# EAGLE design btnsm_a_bit_larger (EAGLE 8.6.0)
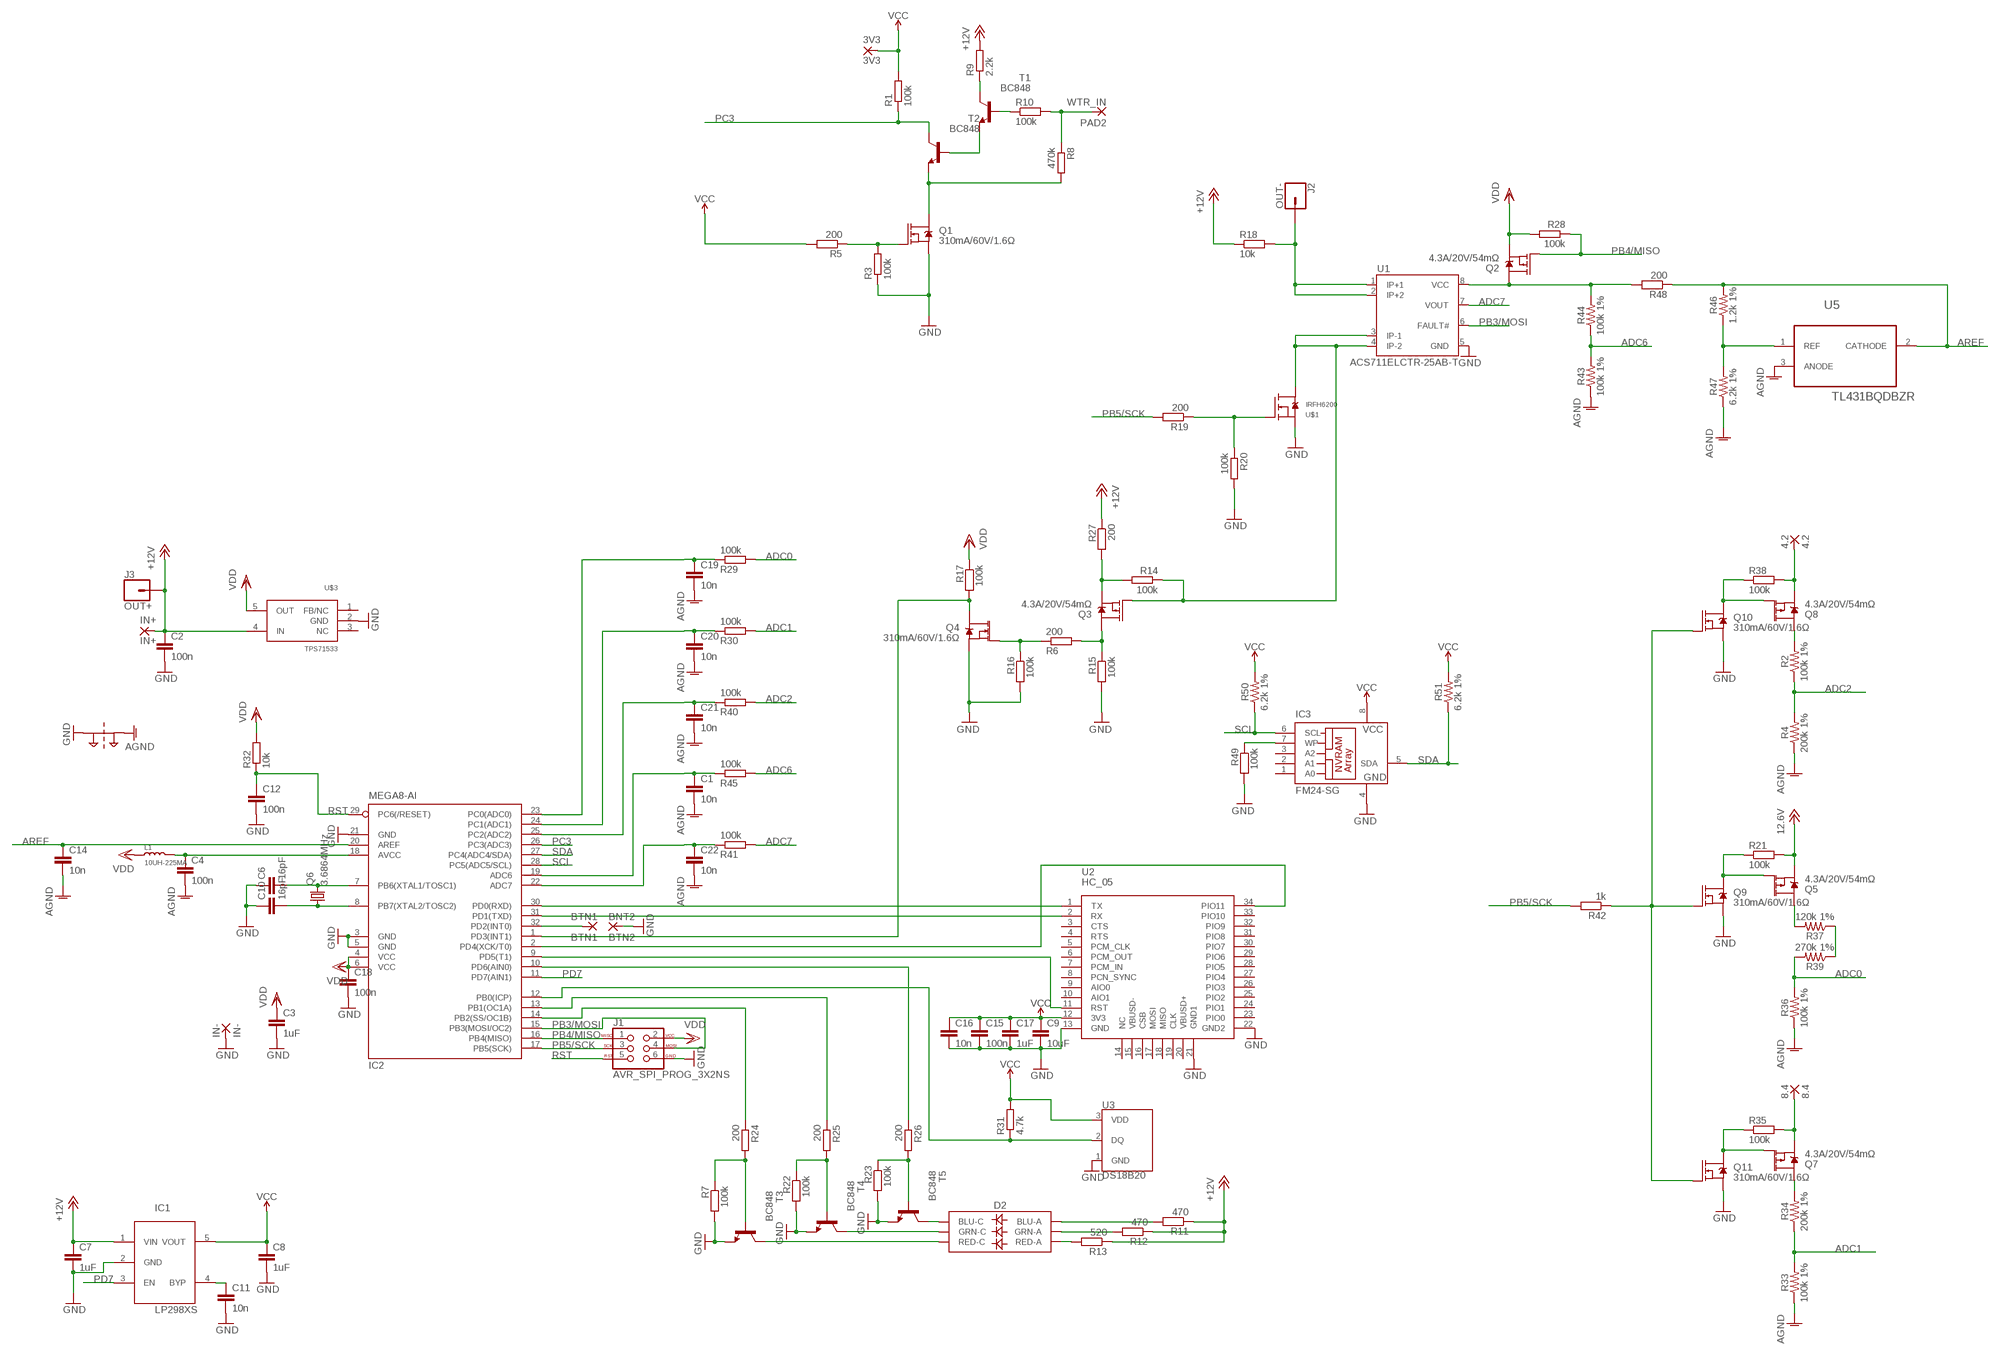
[diagram p0: schematic, sheet 1]

## Parts
3V3  3V3  WIREPADSMD1,27-254  [SMD1,27-2,54]
4.2  4.2  WIREPADSMD1,27-254  [SMD1,27-2,54]
8.4  8.4  WIREPADSMD1,27-254  [SMD1,27-2,54]
BTN1  BTN1  1,6/0,9  [1,6/0,9]
BTN2  BNT2  1,6/0,9  [1,6/0,9]
C1  10n  C-EUC0402  [C0402]
C2  100n  C-EUC0603  [C0603]
C3  1uF  C-EUC0805  [C0805]
C4  100n  C-EUC0402  [C0402]
C6  16pF  C-EUC0402  [C0402]
C7  1uF  C-EUC0805  [C0805]
C8  1uF  C-EUC0805  [C0805]
C9  10uF  C-EUC0805  [C0805]
C10  16pF  C-EUC0402  [C0402]
C11  10n  C-EUC0402  [C0402]
C12  100n  C-EUC0402  [C0402]
C14  10n  C-EUC0402  [C0402]
C15  100n  C-EUC0402  [C0402]
C16  10n  C-EUC0402  [C0402]
C17  1uF  C-EUC0805  [C0805]
C18  100n  C-EUC0402  [C0402]
C19  10n  C-EUC0402  [C0402]
C20  10n  C-EUC0402  [C0402]
C21  10n  C-EUC0402  [C0402]
C22  10n  C-EUC0402  [C0402]
D2  LED-RGBNO_IC  [LED-TRICOLOR-5050]
IC1  LP298XS  [SOT23-5L]
IC2  MEGA8-AI  [TQFP32-08]
IC3  FM24-SG  [SO8]
IN+  IN+  SMD5  [SMD2,54-5,08]
IN-  IN-  SMD5  [SMD2,54-5,08]
J1  AVR_SPI_PROG_3X2NS  [2X3-NS]
J2  OUT-  CONN_01PTH_2MM  [1X01_2MM]
J3  OUT+  CONN_01PTH_2MM  [1X01_2MM]
L1  10UH-225MA  SMD-INDUCTOR-10UH-225MA-10%(0806)  [L0806]
PAD2  WTR_IN  WIREPADSMD1,27-254  [SMD1,27-2,54]
Q1  310mA/60V/1.6Ω  MOSFET-NCH-2N7002PW  [SOT323]
Q2  4.3A/20V/54mΩ  MOSFET_PCH-IRLML2244  [SOT23-3]
Q3  4.3A/20V/54mΩ  MOSFET_PCH-IRLML2244  [SOT23-3]
Q4  310mA/60V/1.6Ω  MOSFET-NCH-2N7002PW  [SOT323]
Q5  4.3A/20V/54mΩ  MOSFET_PCH-IRLML2244  [SOT23-3]
Q6  3.6864MHz  CRYSTALHC49S  [HC49/S]
Q7  4.3A/20V/54mΩ  MOSFET_PCH-IRLML2244  [SOT23-3]
Q8  4.3A/20V/54mΩ  MOSFET_PCH-IRLML2244  [SOT23-3]
Q9  310mA/60V/1.6Ω  MOSFET-NCH-2N7002PW  [SOT323]
Q10  310mA/60V/1.6Ω  MOSFET-NCH-2N7002PW  [SOT323]
Q11  310mA/60V/1.6Ω  MOSFET-NCH-2N7002PW  [SOT323]
R1  100k  R-EU_R0402  [R0402]
R2  100k 1%  RESISTOR0805  [0805]
R3  100k  R-EU_R0402  [R0402]
R4  200k 1%  RESISTOR0805  [0805]
R5  200  R-EU_R0402  [R0402]
R6  200  R-EU_R0402  [R0402]
R7  100k  R-EU_R0402  [R0402]
R8  470k  R-EU_R0402  [R0402]
R9  2.2k  R-EU_R0402  [R0402]
R10  100k  R-EU_R0402  [R0402]
R11  470  R-EU_R0805  [R0805]
R12  470  R-EU_R0805  [R0805]
R13  520  R-EU_R0805  [R0805]
R14  100k  R-EU_R0402  [R0402]
R15  100k  R-EU_R0402  [R0402]
R16  100k  R-EU_R0402  [R0402]
R17  100k  R-EU_R0402  [R0402]
R18  10k  R-EU_R0402  [R0402]
R19  200  R-EU_R0402  [R0402]
R20  100k  R-EU_R0402  [R0402]
R21  100k  R-EU_R0402  [R0402]
R22  100k  R-EU_R0402  [R0402]
R23  100k  R-EU_R0402  [R0402]
R24  200  R-EU_R0402  [R0402]
R25  200  R-EU_R0402  [R0402]
R26  200  R-EU_R0402  [R0402]
R27  200  R-EU_R0402  [R0402]
R28  100k  R-EU_R0402  [R0402]
R29  100k  R-EU_R0402  [R0402]
R30  100k  R-EU_R0402  [R0402]
R31  4.7k  R-EU_R0402  [R0402]
R32  10k  R-EU_R0402  [R0402]
R33  100k 1%  RESISTOR0805  [0805]
R34  200k 1%  RESISTOR0805  [0805]
R35  100k  R-EU_R0402  [R0402]
R36  100k 1%  RESISTOR0805  [0805]
R37  120k 1%  RESISTOR0805  [0805]
R38  100k  R-EU_R0402  [R0402]
R39  270k 1%  RESISTOR0805  [0805]
R40  100k  R-EU_R0402  [R0402]
R41  100k  R-EU_R0402  [R0402]
R42  1k  R-EU_R0402  [R0402]
R43  100k 1%  RESISTOR0805  [0805]
R44  100k 1%  RESISTOR0805  [0805]
R45  100k  R-EU_R0402  [R0402]
R46  1.2k 1%  RESISTOR0805  [0805]
R47  6.2k 1%  RESISTOR0805  [0805]
R48  200  R-EU_R0402  [R0402]
R49  100k  R-EU_R0402  [R0402]
R50  6.2k 1%  RESISTOR0805  [0805]
R51  6.2k 1%  RESISTOR0805  [0805]
SUPPLY7  2PT_GND_TIE  [2PT_GND_TIE]
T1  BC848  [SOT23]
T2  BC848  [SOT23]
T3  BC848  [SOT23]
T4  BC848  [SOT23]
T5  BC848  [SOT23]
U1  ACS711ELCTR-25AB-T  [SOIC8]
U2  HC_05  [BLUETOOTH_SMD]
U3  DS18B20  [TO-92-AMMO]
U5  TL431BQDBZR  [SOT95P237X112-3N]
U$1  IRFH6200  [PQFN]
U$3  TPS71533  TPS715  [SC70]

## Nets
+12V [PWR]: C2.1 C7.1 IC1.1(VIN) IN+.1(P) J3.1 Q5.2(S) R9.2 R11.1 R12.1 R13.1 R18.1 R21.2 R27.1 U$3.4(IN) ; supply symbol labelled 12.6V
_A0: C19.1 IC2.23(PC0(ADC0)) R29.1
_A1: C20.1 IC2.24(PC1(ADC1)) R30.1
_A2: C21.1 IC2.25(PC2(ADC2)) R40.1
_A6: C1.1 IC2.19(ADC6) R45.1
_A7: C22.1 IC2.22(ADC7) R41.1
ADC0 [ADC]: R29.2 R36.2 R39.2
ADC1 [ADC]: R30.2 R33.2 R34.1
ADC2 [ADC]: R2.1 R4.2 R40.2
ADC6 [ADC]: R43.2 R44.1 R45.2
ADC7 [ADC]: R41.2 U1.7(VOUT)
AGND [ADC]: C1.2 C4.2 C14.2 C19.2 C20.2 C21.2 C22.2 R4.1 R33.1 R36.1 R43.1 R47.1 SUPPLY7.P$2 U5.3(ANODE)
AREF [ADC]: C14.1 IC2.20(AREF) R46.2 R48.1 U5.2(CATHODE)
AVCC [ADC]: C4.1 IC2.18(AVCC) L1.2
B+: D2.3(BLU-A) R11.2
B-: D2.4(BLU-C) T5.3(C)
B-BASE: R23.1 R26.2 T5.1(B)
BTN1: BTN1.1(P) IC2.32(PD2(INT0))
G+: D2.1(GRN-A) R12.2
G-: D2.6(GRN-C) T4.3(C)
G-BASE: R22.1 R25.2 T4.1(B)
GND [PWR]: BTN2.1(P) C2.2 C3.2 C6.1 C7.2 C8.2 C9.2 C10.1 C11.2 C12.2 C15.2 C16.2 C17.2 C18.2 IC1.2(GND) IC2.3(GND) IC2.5(GND) IC2.21(GND) IC3.4(GND) IN-.1(P) J1.6 Q1.2(S) Q4.2(S) Q9.2(S) Q10.2(S) Q11.2(S) R3.1 R7.2 R15.2 R16.2 R20.2 R22.2 R23.2 R49.2 SUPPLY7.P$1 T3.2(E) T4.2(E) T5.2(E) U1.5(GND) U2.13(GND) U2.21(GND1) U2.22(GND2) U3.1(GND) U$1.1(S) U$1.2(S) U$1.3(S) U$3.2(GND)
GND_OUT: J2.1 R18.2 U1.1(IP+1) U1.2(IP+2)
GND_OUT_MEASURE: Q3.1(G) R14.1 U1.3(IP-1) U1.4(IP-2) U$1.5(D) U$1.6(D) U$1.7(D) U$1.8(D) U$1.9(D)
N$1: Q4.1(G) R6.1 R16.1
N$2: C11.1 IC1.4(BYP)
N$3: Q7.1(G) Q11.3(D) R35.1
N$4: Q1.3(D) R8.2 T2.2(E)
N$5: Q7.3(D) R34.2
N$6: Q8.1(G) Q10.3(D) R38.1
N$7: Q8.3(D) R2.2
N$8: R37.1 R39.1
N$9: Q3.3(D) R6.2 R15.1
N$10 [PWR]: 8.4.1(P) Q7.2(S) R35.2
N$11: Q5.1(G) Q9.3(D) R21.1
N$12 [PWR]: 4.2.1(P) Q8.2(S) R38.2
N$13: T1.2(E) T2.1(B)
N$14: Q2.3(D) R44.2 R48.2 U1.8(VCC)
N$17: R10.1 T1.1(B)
N$19: Q9.1(G) Q10.1(G) Q11.1(G) R42.1
N$23: Q5.3(D) R37.2
N$26 [ADC]: IC3.7(WP) R49.1
N$32: Q3.2(S) R14.2 R27.2
OUT_BASE: R19.1 R20.1 U$1.4(G)
PB0: IC2.12(PB0(ICP)) R31.1 U3.2(DQ)
PB1: IC2.13(PB1(OC1A)) R25.1
PB2: IC2.14(PB2(SS/OC1B)) R24.1
PB3/MOSI: IC2.15(PB3(MOSI/OC2)) J1.4 U1.6(FAULT#)
PB4/MISO: IC2.16(PB4(MISO)) J1.1 Q2.1(G) R28.1
PB5/SCK: IC2.17(PB5(SCK)) J1.3 R19.2 R42.2
PB6: C6.2 IC2.7(PB6(XTAL1/TOSC1)) Q6.2
PB7: C10.2 IC2.8(PB7(XTAL2/TOSC2)) Q6.1
PC3: IC2.26(PC3(ADC3)) R1.1 T2.3(C)
PD3: IC2.1(PD3(INT1)) Q4.3(D) R17.2
PD4-HC05_KEY: IC2.2(PD4(XCK/T0)) U2.34(PIO11)
PD5-HC05_RST: IC2.9(PD5(T1)) U2.11(RST)
PD6(PWM0): IC2.10(PD6(AIN0)) R26.1
PD7: IC1.3(EN) IC2.11(PD7(AIN1))
R+: D2.2(RED-A) R13.2
R-: D2.5(RED-C) T3.3(C)
R-BASE: R7.1 R24.2 T3.1(B)
REF: R46.1 R47.2 U5.1(REF)
RST: C12.1 IC2.29(PC6(/RESET)) J1.5 R32.1
RX(UC): IC2.30(PD0(RXD)) U2.1(TX)
SCL: IC2.28(PC5(ADC5/SCL)) IC3.6(SCL) R50.1
SDA: IC2.27(PC4(ADC4/SDA)) IC3.5(SDA) R51.1
TX(UC): IC2.31(PD1(TXD)) U2.2(RX)
VCC [PWR]: 3V3.1(P) C8.1 C9.1 C15.1 C16.1 C17.1 IC1.5(VOUT) IC3.8(VCC) R1.2 R5.2 R31.2 R50.2 R51.2 U2.12(3V3) U3.3(VDD)
VDD [PWR]: C3.1 C18.1 IC2.4(VCC) IC2.6(VCC) J1.2 L1.1 Q2.2(S) R17.1 R28.2 R32.2 U$3.5(OUT)
WTR-IN: PAD2.1(P) R8.1 R10.2
WTR_MEASURE_ON: Q1.1(G) R3.2 R5.1
WTR_MEASURE_PULLUP: R9.1 T1.3(C)
Unconnected: IC3.1(A0) IC3.2(A1) IC3.3(A2) U2.3(CTS) U2.4(RTS) U2.5(PCM_CLK) U2.6(PCM_OUT) U2.7(PCM_IN) U2.8(PCN_SYNC) U2.9(AIO0) U2.10(AIO1) U2.14(NC) U2.15(VBUSD-) U2.16(CSB) U2.17(MOSI) U2.18(MISO) U2.19(CLK) U2.20(VBUSD+) U2.23(PIO0) U2.24(PIO1) U2.25(PIO2) U2.26(PIO3) U2.27(PIO4) U2.28(PIO5) U2.29(PIO6) U2.30(PIO7) U2.31(PIO8) U2.32(PIO9) U2.33(PIO10) U$3.1(FB/NC) U$3.3(NC)

## Library data of the parts
3V3 4.2 8.4 PAD2 = wirepad:WIREPAD: Wire PAD connect wire on PCB
BTN1 BTN2 = wirepad:1,6/0,9: THROUGH-HOLE PAD
C1-C4 C6-C12 C14-C22 = resistor:C-EU: CAPACITOR, European symbol
D2 = SparkFun-LED:LED-RGB: LED-RGB 6 pin RGB LED (no common connector) Packages: PLCC-6 LED-TRICOLOR-5050 - No built-in IC SparkFun Products: Digital Sandbox <https://www.sparkfun.com/products/12651> LED- SMD RGB <https://www.sparkfun.com/products/10866>; PROD_ID: DIO-10298
IC1 = adafruit:LP298X
IC2 = atmel:MEGA8: MICROCONTROLLER 8 Kbytes FLASH, 1 kbytes SRAM, 512 bytes EEPROM, USART, 6-channel 10 bit ADC, 2-channel 8 bit ADC Pin compatible with Atmega48, ATMega88, ATMega168 Source: avr.lbr; MPN: ATMEGA8-16AU; OC_FARNELL: 9171371; OC_NEWARK: 73M8863
IC3 = ramtron-2:FM24*: I2C NVRAM 8 pin
IN+ IN- = wirepad:SMD5: SMD PAD
J1 = SparkFun-Connectors:AVR_SPI_PROG_3X2: AVR ISP 6 Pin This is the reduced ISP connector for AVR programming. Common on Arduino. This footprint will take up less PCB space and can be used with a 10-pin to 6-pin adapter such as SKU: BOB-08508 **Special note about "TEST_POINT" package. The stop mask is on the top side, so if you want your programming test points to be on the bottom of your board, make sure to place this package on the bottom side of the board. This also ensure that the orientation to program from the bottom side will be correct. SparkFun Products: SparkFun ISP Pogo Adapter <https://www.sparkfun.com/products/11591> - NS Tiny AVR Programmer <https://www.sparkfun.com/products/11801> -PTH
J2 J3 = SparkFun-Connectors:CONN_01: Single connection point. Often used as Generic Header-pin footprint for 0.1 inch spaced/style header connections On any of the 0.1 inch spaced packages, you can populate with these: Break Away Headers - Straight <https://www.sparkfun.com/products/116> (PRT-00116) Break Away Male Headers - Right Angle <https://www.sparkfun.com/products/553> (PRT-00553) Female Headers <https://www.sparkfun.com/products/115> (PRT-00115) Break Away Headers - Machine Pin <https://www.sparkfun.com/products/117> (PRT-00117) Break Away Female Headers - Swiss Machine Pin <https://www.sparkfun.com/products/743> (PRT-00743) This device is also useful as a general connection point to wire up your design to another part of your project. Our various solder wires solder well into these plated through hole pads. Hook-Up Wire - Assortment (Stranded, 22 AWG) <https://www.sparkfun.com/products/11375> (PRT-11375) Hook-Up Wire - Assortment (Solid Core, 22 AWG) <https://www.sparkfun.com/products/11367> (PRT-11367) View the entire wire category on our website here <https://www.sparkfun.com/categories/141> Special notes: SMTSO-256-ET is a "flush mount" nut for a 4-40 screw. We mostly use this on specialty testbeds; it is a nice way to connect hardware to your PCB at an adjustable hieght. Also note, the SNAP packages are for using a snappable style connector. We sell a baggie of snaps and they are also used on two LilyPad designs: Snap Assortment - 30 pack (male and female) <https://www.sparkfun.com/products/11347> (DEV-11347) LilyPad Arduino SimpleSnap <https://www.sparkfun.com/products/10941> (DEV-10941) LilyPad SimpleSnap Protoboard <https://www.sparkfun.com/products/10940> (DEV-10940)
L1 = Seeed-Inductor:SMD-INDUCTOR-10UH-225MA-10%(0806): 303010042; MPN: LQH2MCN100K02L
Q1 Q4 Q9-Q11 = SparkFun-DiscreteSemi:MOSFET-NCH: N-channel MOSFETs Voltage controlled devices that allow control of high current outputs. SparkFun Products: SparkFun OpenScale <https://www.sparkfun.com/products/13261> SparkFun Digital Sandbox <https://www.sparkfun.com/products/12651> SparkFun Monster Moto Shield <https://www.sparkfun.com/products/10182> SparkFun MOSFET Power Controller <https://www.sparkfun.com/products/11214>; PROD_ID: TRANS-11151
Q2 Q3 Q5 Q7 Q8 = SparkFun-DiscreteSemi:MOSFET_PCH: P-channel MOSFETs Voltage controlled devices that allow control of high current outputs. SparkFun Products: SparkFun ESP32 Thing <https://www.sparkfun.com/products/13907> SparkFun ESP8266 Thing <https://www.sparkfun.com/products/13231>; PROD_ID: TRANS-11153
Q6 = adafruit:CRYSTAL: CRYSTAL; OC_FARNELL: 1667008; OC_NEWARK: unknown
R1 R3 R5-R32 R35 R38 R40-R42 R45 R48 R49 = rcl:R-EU_: RESISTOR, European symbol; SPICEPREFIX: R
R2 R4 R33 R34 R36 R37 R39 R43 R44 R46 R47 R50 R51 = SparkFun-Resistors:RESISTOR: Generic Resistor Package
SUPPLY7 = SparkFun-PowerSymbols:2PT_GND_TIE: Dual Ground Supply Power supply symbol for connecting two grounds. SparkFun Products: SparkFun AutoDriver - Stepper Motor Driver <https://www.sparkfun.com/products/11611>
T1 T3-T5 = transistor-neu-to92:BC848: NPN TRANSISTOR
T2 = transistor-neu-to92:BC848: NPN TRANSISTOR; SPICEPREFIX: Q
U1 = allegro:ACS711E: SENSOR CURRENT 3.3V 8-SOIC tested: YES (etherbotix); CURRENT: 25A
U2 = Bluetooth HC-05:HC_05: HC-05 Bluetooth Module
U3 = SparkFun-Sensors:DS18B20: Dallas/Maxim DS18B20 1-Wire Temperature Sensor The DS18B20 reports degrees C with 9 to 12-bit precision, -55C to 125C (+/-0.5C). Each sensor has a unique 64-Bit Serial number etched into it - allows for a huge number of sensors to be used on one data bus. Datasheet <http://datasheets.maximintegrated.com/en/ds/DS18B20.pdf> SparkFun Products One Wire Digital Temperature Sensor - DS18B20 <https://www.sparkfun.com/products/245> (SEN-00245); STORE_ID: SEN-00245
U5 = TL431BQDBZR:TL431BQDBZR: PRECISION PROGRAMMABLE REFERENCE; MPN: TL431BQDBZR; OC_FARNELL: 1764815; OC_NEWARK: 44J2402; PACKAGE: SOT23-3; SUPPLIER: Texas Instruments
U$1 = IRFH6200:IRFH6200
U$3 = TPS715:TPS715

## Net classes
0 default: width 0.152 mm, drill 0.3 mm, clearance 0.152 mm
1 PWR: width 0.381 mm, drill 0.4 mm, clearance 0.152 mm
2 ADC: width 0.254 mm, drill 0.3 mm, clearance 0.152 mm

## Board
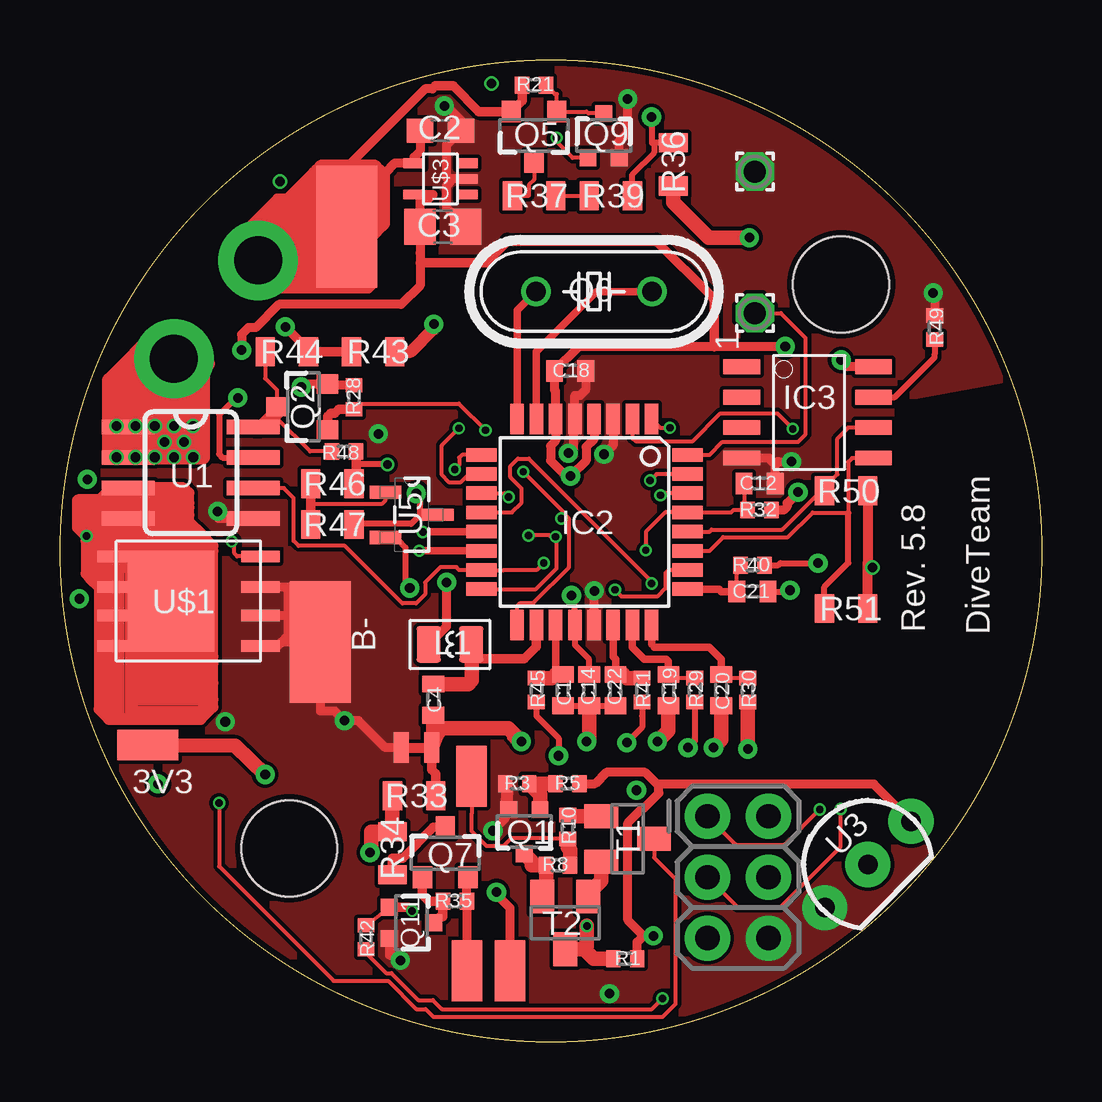
[diagram p1: board, top side]
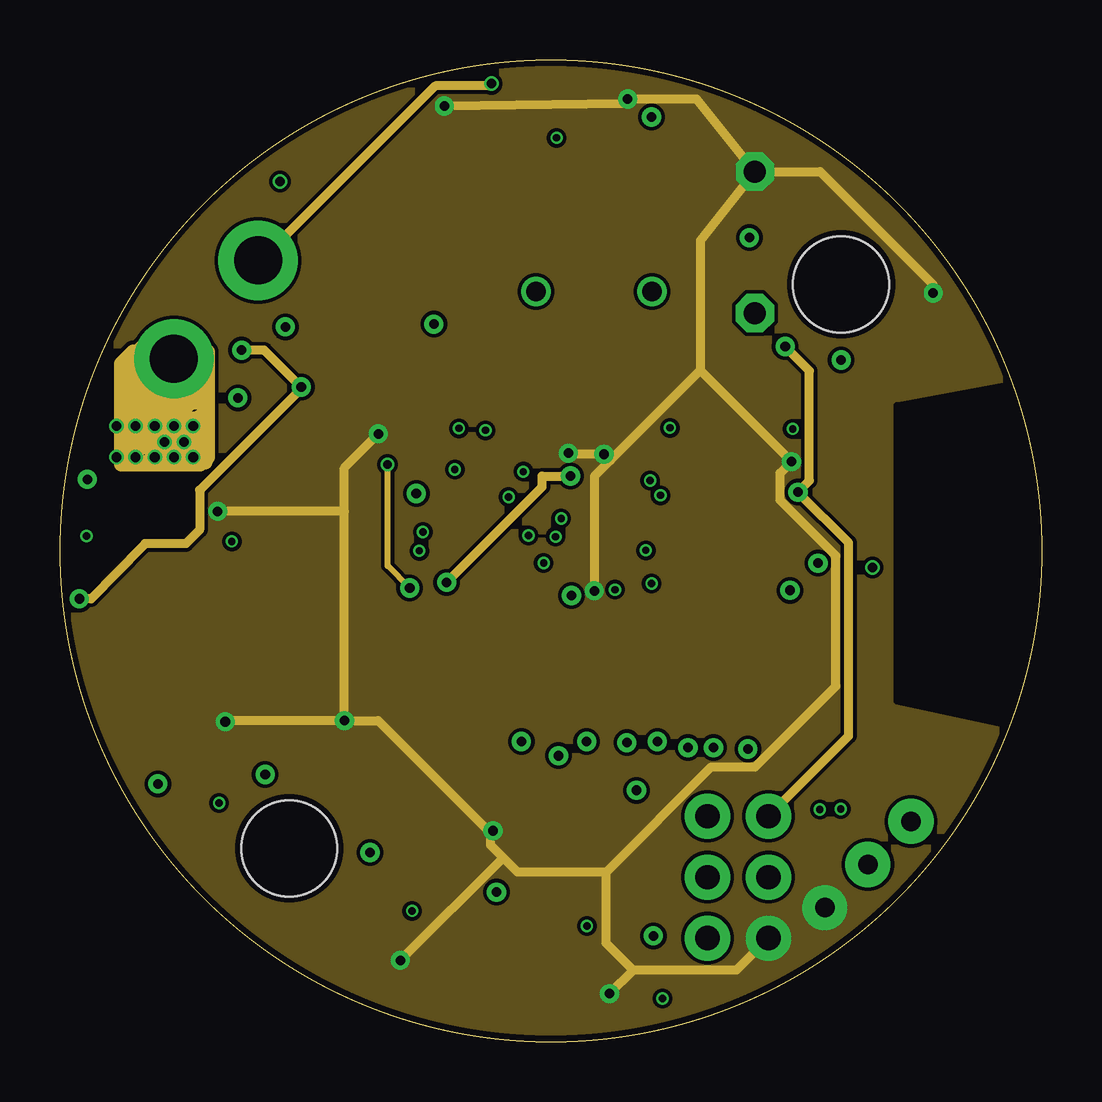
[diagram p2: board, inner layer Route2]
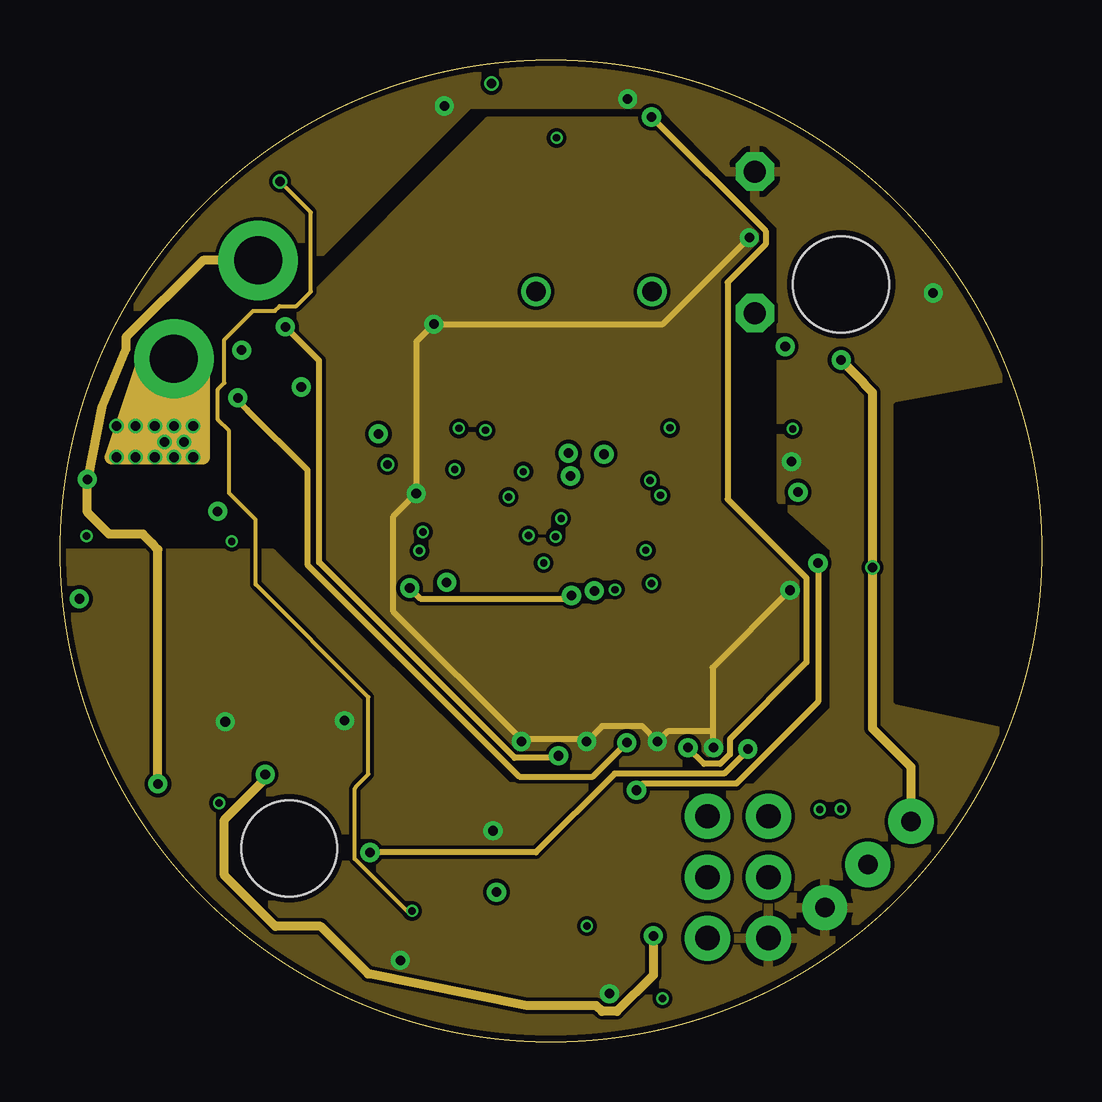
[diagram p3: board, inner layer Route15]
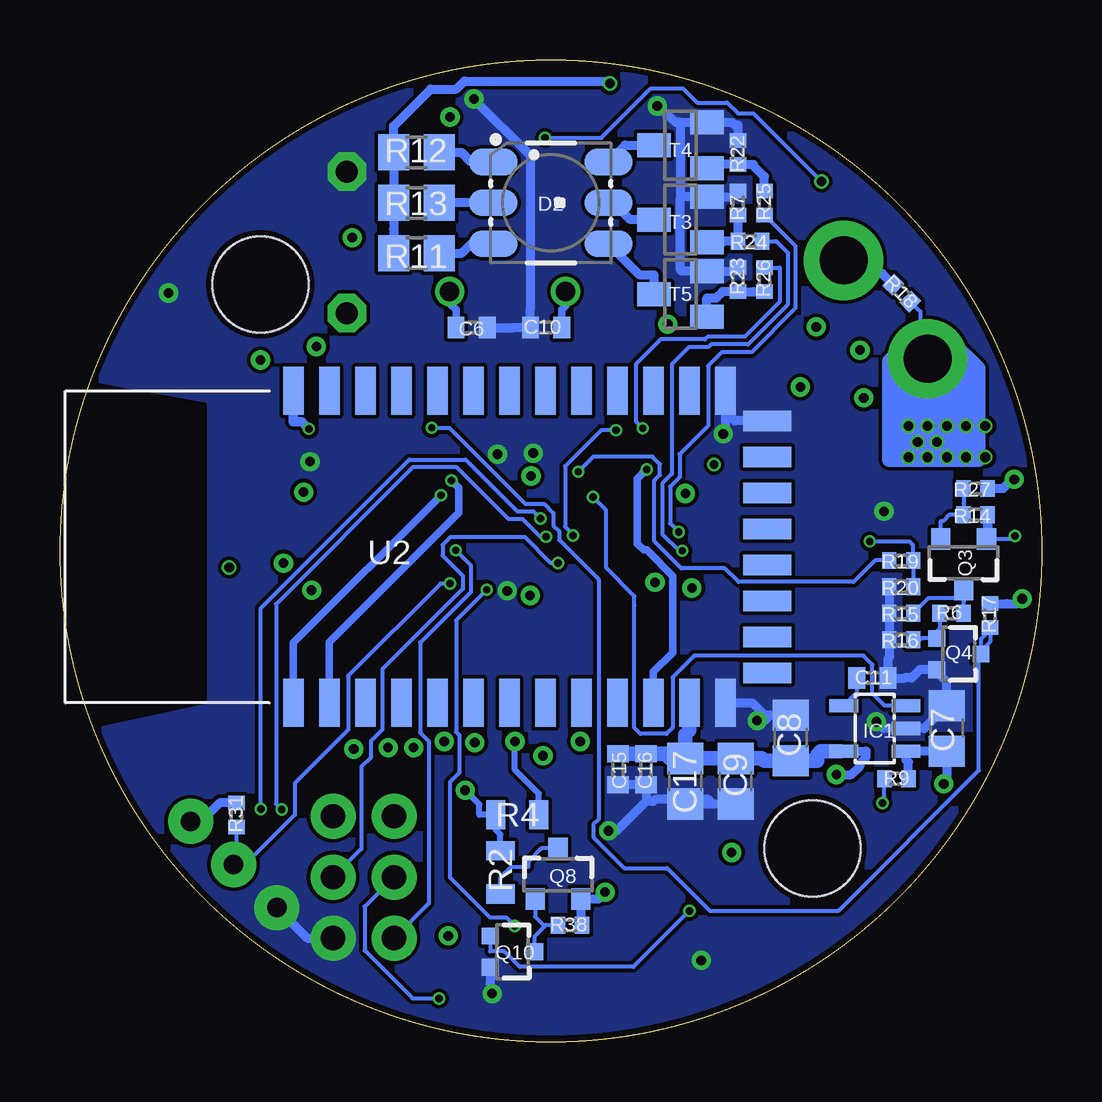
[diagram p4: board, bottom side, seen from below]

Size 40.9 x 40.9 mm. Coordinates in mm from the lower left corner, seen from the top.
Outline: circle at 20.45,20.45 radius 20.45
Copper layers (1*2*15*16): Top 0.035mm / dielectric 0.2mm / Route2 0.0175mm / dielectric 0.3mm / Route15 0.0175mm / dielectric 0.2mm / Bottom 0.035mm
Design rules "SeeedStudio_4layer_DRU_no_angle_20140221 *": minimum track width 6mil, minimum drill 12mil, track to track 6mil, track to pad 6mil, pad to pad 6mil, via to via 6mil, smd to smd 0mil, copper to edge 10mil, drill to drill 12mil, minimum pad ring 6mil, minimum via ring 4mil, stop-mask expansion 4mil, vias tented up to drill 25mil, thermal gap 10mil
Holes 4 mm at 9.55,8.05 32.55,31.55
tRestrict: area 34.8,12.8 to 41.3,27.8; area 34.8,12.8 to 41.3,27.8
bRestrict: area 34.8,12.8 to 41.3,27.8
vRestrict: area 34.8,12.8 to 41.5,27.8

### Footprints (pad centres in the part's own frame; a part is rotated, then mirrored left to right if it is on the bottom)
SMD1,27-2,54 = smd 1.27 x 2.54: 1 0,0
1,6/0,9 = drill 0.914 pad 1.6 octagon: 1 0,0
C0402 = smd 0.7 x 0.9: 1 -0.65,0; 2 0.65,0
C0603 = smd 1.1 x 1: 1 -0.85,0; 2 0.85,0
C0805 = smd 1.3 x 1.5: 1 -0.95,0; 2 0.95,0
LED-TRICOLOR-5050 = smd 2 x 1.1: 1 -2.4,1.7; 2 -2.4,0; 3 -2.4,-1.7; 4 2.4,-1.7; 5 2.4,0; 6 2.4,1.7
SOT23-5L = smd 0.55 x 1.2: 1 -0.95,-1.3; 2 0,-1.3; 3 0.95,-1.3; 4 0.95,1.3; 5 -0.95,1.3
TQFP32-08 = smd 1.27 x 0.559: 1 -4.293,2.8; 2 -4.293,2; 3 -4.293,1.2; 4 -4.293,0.4; 5 -4.293,-0.4; 6 -4.293,-1.2; 7 -4.293,-2; 8 -4.293,-2.8; 17 4.293,-2.8; 18 4.293,-2; 19 4.293,-1.2; 20 4.293,-0.4; 21 4.293,0.4; 22 4.293,1.2; 23 4.293,2; 24 4.293,2.8 | smd 0.559 x 1.27: 9 -2.8,-4.293; 10 -2,-4.293; 11 -1.2,-4.293; 12 -0.4,-4.293; 13 0.4,-4.293; 14 1.2,-4.293; 15 2,-4.293; 16 2.8,-4.293; 25 2.8,4.293; 26 2,4.293; 27 1.2,4.293; 28 0.4,4.293; 29 -0.4,4.293; 30 -1.2,4.293; 31 -2,4.293; 32 -2.8,4.293
SO8 = smd 0.61 x 1.524: 1 -1.27,-2.743; 2 0,-2.743; 3 1.27,-2.743; 4 2.54,-2.743; 5 2.54,2.743; 6 1.27,2.743; 7 0,2.743; 8 -1.27,2.743
SMD2,54-5,08 = smd 2.54 x 5.08: 1 0,0
2X3-NS = drill 1.016 pad 1.88: 1 -2.54,-1.27; 2 -2.54,1.27; 3 0,-1.27; 4 0,1.27; 5 2.54,-1.27; 6 2.54,1.27
1X01_2MM = drill 2 pad 3.302: 1 0,0
L0806 = smd 1.016 x 1.524: 1 -0.889,0; 2 0.889,0
SOT323 = smd 0.7 x 0.7: 1 -0.65,-0.925; 2 0.65,-0.925; 3 0,0.925
SOT23-3 = smd 0.8 x 0.9: 1 -0.95,-1; 2 0.95,-1; 3 0,1.1
HC49/S = drill 0.813: 1 -2.413,0; 2 2.413,0
R0402 = smd 0.6 x 0.7: 1 -0.5,0; 2 0.5,0
0805 = smd 0.8 x 1.2: 1 -0.9,0; 2 0.9,0
R0805 = smd 1.3 x 1.5: 1 -0.95,0; 2 0.95,0
2PT_GND_TIE = smd 1.27 x 0.635: P$1 0,0.635; P$2 0,-0.635
SOT23 = smd 1 x 1.4: 1 -0.95,-1.1; 2 0.95,-1.1; 3 0,1.1
SOIC8 = smd 0.6 x 2.2: 1 -1.905,-2.6; 2 -0.635,-2.6; 3 0.635,-2.6; 4 1.905,-2.6; 5 1.905,2.6; 6 0.635,2.6; 7 -0.635,2.6; 8 -1.905,2.6
BLUETOOTH_SMD = smd 2 x 0.85: 1 -6.35,3.81; 2 -6.35,2.31; 3 -6.35,0.81; 4 -6.35,-0.69; 5 -6.35,-2.19; 6 -6.35,-3.69; 7 -6.35,-5.19; 8 -6.35,-6.69; 9 -6.35,-8.19; 10 -6.35,-9.69; 11 -6.35,-11.19; 12 -6.35,-12.69; 13 -6.35,-14.19; 22 6.65,-14.19; 23 6.65,-12.69; 24 6.65,-11.19; 25 6.65,-9.69; 26 6.65,-8.19; 27 6.65,-6.69; 28 6.65,-5.19; 29 6.65,-3.69; 30 6.65,-2.19; 31 6.65,-0.69; 32 6.65,0.81; 33 6.65,2.31; 34 6.65,3.81 | smd 0.85 x 2: 14 -5.1,-15.94; 15 -3.6,-15.94; 16 -2.1,-15.94; 17 -0.6,-15.94; 18 0.9,-15.94; 19 2.4,-15.94; 20 3.9,-15.94; 21 5.4,-15.94
TO-92-AMMO = drill 0.813 pad 1.88: 1 -2.54,0; 2 0,0; 3 2.54,0
SOT95P237X112-3N = smd 1.321 x 0.559: 1 -1.092,0.94; 2 -1.092,-0.94 | smd 1.321 x 0.508: 3 1.092,0
PQFN = smd 1.6 x 0.48: 1 -3,1.865; 2 -3,0.595; 3 -3,-0.595; 4 -3,-1.865; 5 3,-1.865; 6 3,-0.595; 7 3,0.595; 8 3,1.865 | smd 3.6 x 4.2: 9 0.725,0
SC70 = smd 0.9 x 0.4: 1 -1.1,0.65; 2 -1.1,0; 3 -1.1,-0.65; 4 1.1,-0.65; 5 1.1,0.65

### Placement (x,y rotation side)
3V3  3.65,12.35 90 top
4.2  18.75,2.95 180 top
8.4  16.95,2.95 0 top
BTN1  28.95,30.35 0 top
BTN2  28.95,36.25 0 top
C1  20.95,14.65 270 top
C2  15.85,37.95 0 top
C3  15.95,33.95 0 top
C4  15.55,14.25 270 top
C6  23.75,29.75 180 bottom
C7  3.95,13.05 90 bottom
C8  10.45,12.65 90 bottom
C9  12.75,10.85 270 bottom
C10  20.65,29.75 0 bottom
C11  7.05,15.15 0 bottom
C12  29.15,23.25 0 top
C14  22.05,14.65 270 top
C15  17.65,11.35 270 bottom
C16  16.48,11.35 270 bottom
C17  14.85,10.85 270 bottom
C18  21.25,27.95 0 top
C19  25.35,14.65 270 top
C20  27.55,14.65 270 top
C21  28.85,18.75 0 top
C22  23.15,14.65 270 top
D2  20.45,34.95 0 bottom
IC1  6.95,13.05 90 bottom
IC2  21.85,21.65 270 top
IC3  31.15,26.85 270 top
IN+  11.95,33.95 180 top
IN-  10.85,16.65 180 top
J1  28.25,6.85 270 top
J2  4.75,28.45 0 top
J3  8.25,32.55 0 top
L1  16.25,16.55 0 top
PAD2  17.15,11.05 0 top
Q1  19.35,8.75 180 top
Q2  10.15,26.45 90 top
Q3  3.25,19.95 180 bottom
Q4  3.45,16.15 270 bottom
Q5  19.75,37.75 180 top
Q6  22.25,31.25 0 top
Q7  16.05,7.85 0 top
Q8  20.15,6.95 0 bottom
Q9  22.65,37.75 0 top
Q10  22.05,3.75 270 bottom
Q11  14.65,4.95 270 top
R1  23.55,3.45 0 top
R2  22.55,7.05 270 bottom
R3  19.05,10.75 0 top
R4  21.85,9.45 180 bottom
R5  21.15,10.75 0 top
R6  3.75,17.85 0 bottom
R7  12.65,34.95 90 bottom
R8  20.75,7.35 180 top
R9  6.05,10.95 0 bottom
R10  21.15,8.95 270 top
R11  26.05,32.85 0 bottom
R12  26.05,37.05 0 bottom
R13  26.05,34.95 0 bottom
R14  2.75,21.95 180 bottom
R15  5.85,17.85 180 bottom
R16  5.85,16.75 180 bottom
R17  2.15,17.75 270 bottom
R18  5.82,31.19 315 bottom
R19  5.85,20.05 180 bottom
R20  5.85,18.95 180 bottom
R21  19.75,39.85 180 top
R22  12.65,37.05 90 bottom
R23  12.65,31.75 90 bottom
R24  12.15,33.35 180 bottom
R25  11.55,34.95 90 bottom
R26  11.55,31.75 270 bottom
R27  2.75,23.05 180 bottom
R28  12.25,26.85 90 top
R29  26.45,14.65 270 top
R30  28.65,14.65 270 top
R31  33.55,9.45 90 bottom
R32  29.15,22.15 0 top
R33  14.75,10.25 180 top
R34  13.85,7.85 270 top
R35  16.45,5.85 0 top
R36  25.55,36.55 90 top
R37  19.75,35.25 180 top
R38  19.65,4.85 0 bottom
R39  22.95,35.25 0 top
R40  28.85,19.85 0 top
R41  24.25,14.65 270 top
R42  12.75,4.35 270 top
R43  13.05,28.75 180 top
R44  9.45,28.75 180 top
R45  19.85,14.65 270 top
R46  11.35,23.25 0 top
R47  11.35,21.55 180 top
R48  11.84,24.59 180 top
R49  36.45,29.75 90 top
R50  32.75,22.95 0 top
R51  32.75,18.05 0 top
SUPPLY7  14.85,12.25 90 top
T1  23.65,8.45 270 top
T2  21.05,4.95 180 top
T3  15.05,34.25 90 bottom
T4  15.05,37.35 90 bottom
T5  15.05,31.15 90 bottom
U1  5.45,23.7 270 top
U2  27.37,20.47 90 bottom
U3  33.66,7.38 45 top
U5  14.65,21.95 0 top
U$1  5.35,18.35 180 top
U$3  15.85,35.95 180 top

### Tracks (layer width: path | path; a pad name or v marks a point on that pad's centre or on a via)
+12V  (via drill 0.4 pad 0.38, 0.4 pad 0.8)
  Top 0.381: 15.64,39.82 15.52,39.7 15.21,39.7 12.05,36.53 11.93,36.53 11.85,36.45 IN+.1 | C2.1 15,37.11 14.75,36.86 U$3.4 13.96,36.6 13.56,36.21 13.56,34.06 13.45,33.95 IN+.1 | IN+.1 10.34,33.95 9.15,33.95 11.35,33.15 11.05,32.85 10.25,32.85 10.15,32.95 9.95,32.95 10.25,33.25 10.25,33.75 9.75,33.25 9.45,33.25 10.15,32.55 10.15,32.25 10.35,32.45 10.35,34.35 9.15,33.15 9.05,33.15 10.15,32.05 10.15,31.85 10.55,32.25 10.55,34.95 8.95,33.35 8.55,33.35 10.65,35.45 9.95,34.75 9.45,34.75 8.25,33.55 10.15,31.65 10.35,31.65 10.75,32.05 10.75,36.05 9.65,34.95 9.45,34.95 9.35,34.85 9.15,34.85 8.25,33.95 8.25,33.85 7.65,33.25 7.65,32.45 7.65,33.15 7.25,33.55 7.25,33.05 8.95,31.35 12.85,31.35 13.05,31.55 9.25,31.55 J3.1 | J3.1 8.94,32.55 8.35,32.95 9.65,31.65 11.45,31.65 11.85,32.05 11.85,33.45 12.45,34.05 13.55,34.05 12.35,32.85 13.25,33.75 13.25,34.15 13.35,34.25 13.35,36.35 13.15,36.55 10.85,36.55 10.65,36.35 10.55,36.25 9.45,35.15 9.05,35.15 7.75,33.85 7.65,33.85 8.25,33.25 J3.1
  Top 0.4: 15.64,39.82 16.38,39.82 17.45,38.75 Q5.2 19.25,39.2 R21.2
  Route2 0.381: v17.98,39.91 17.89,39.82 15.64,39.82 8.37,32.55 J3.1
  Route15 0.381: v4.07,10.74 4.07,20.5 3.85,20.75 3.45,21.15 2.05,21.15 1.14,22.06 v1.14,23.43 1.15,23.45 1.16,23.46 1.75,26.45 2.75,28.86 2.75,29.34 5.96,32.55 J3.1
  Bottom 0.381: v4.07,10.74 3.95,10.86 3.95,11.11 C7.1 IC1.1 5.65,11.74 5.55,11.64 R9.2 | R27.1 1.61,23.05 1.23,23.43 v1.14,23.43 | J3.1 7.69,31.99 6.63,31.99 R18.1 | v17.98,39.91 18.09,40.02 24.05,40.02 24.39,39.68 25.46,39.68 27,38.14 R12.1 R13.1 27,33.86 R11.1
  Bottom 0.4: R18.1
_A0
  Top 0.17: C19.1 25.66,15.3 25.81,15.15 R29.1
  Top 0.305: C19.1 25.35,15.85 25.26,15.94 24.35,15.94 23.85,16.43 IC2.23
_A1
  Top 0.17: R30.1 28.01,15.15 27.86,15.3 C20.1
  Top 0.305: C20.1 27.55,15.94 27.05,16.43 24.77,16.43 24.65,16.55 IC2.24
_A2
  Top 0.17: R40.1 28.2,19.7 28.2,19.49 C21.1
  Top 0.305: C21.1 27.56,18.75 27.46,18.85 IC2.25
_A6
  Top 0.17: 20.49,15.15 20.64,15.3 20.65,15.3
  Top 0.305: IC2.19 20.65,15.3
  Top 0.61: 20.65,15.3 C1.1 | R45.1 20.49,15.15
_A7
  Top 0.17: 23.46,15.3 23.61,15.15
  Top 0.305: C22.1 23.15,15.94 23.05,16.04 IC2.22
  Top 0.61: R41.1 23.61,15.15 | C22.1 23.46,15.3
ADC0  (via drill 0.4 pad 0.8)
  Top 0.254: v26.17,12.25 26.45,12.53 26.45,13.57 R29.2 | 24.76,37.45 24.76,37.04 23.85,36.13 R39.2 | R36.2 24.76,37.45 | 24.76,37.45 24.67,37.45 24.67,38.5 v24.65,38.52
  Route15 0.254: v24.65,38.52 v24.66,38.52 29.4,33.78 29.4,33.22 27.81,31.63 27.81,22.61 31.1,19.32 31.1,15.8 27.91,12.61 27.91,11.97 27.51,11.57 26.84,11.57 v26.17,12.25
ADC1  (via drill 0.4 pad 0.8)
  Top 0.254: v12.91,7.88 12.97,7.94 | v28.65,12.2 v28.66,12.19
  Top 0.61: 12.97,7.94 12.97,8.75 R34.1 13.85,9.43 R33.2 | v28.65,12.2 28.65,13.57 R30.2
  Route15 0.254: v28.66,12.19 28.66,12.15 27.68,11.16 23.11,11.16 19.83,7.88 v12.91,7.88
ADC2  (via drill 0.4 pad 0.8)
  Top 0.254: v31.59,19.93 30.01,19.93 29.93,19.85 R40.2
  Route15 0.254: v31.59,19.93 31.59,14.15 28.19,10.75 24.3,10.75 v24.02,10.47
  Bottom 0.254: v24.02,10.47 23.43,9.88 23.43,9.45 R4.2 22.75,8.83 22.55,8.63 R2.1
ADC6  (via drill 0.4 pad 0.8)
  Top 0.254: v9.39,29.78 | v20.77,11.91 20.77,12.65 19.85,13.57 R45.2 | R44.1 10.43,28.75
  Top 0.4: v9.39,29.78 10.43,28.75 R43.2
  Route15 0.254: v20.77,11.91 20.68,11.82 18.94,11.82 10.79,19.97 10.79,28.38 v9.39,29.78
ADC7  (via drill 0.4 pad 0.8)
  Top 0.254: v23.62,12.46 24.25,13.09 24.25,13.57 R41.2 | v7.41,26.82 7.25,26.75 6.62,26.12 6.62,24.47 6.76,24.34 U1.7
  Route15 0.254: v7.41,26.82 7.35,26.75 7.81,26.31 10.31,23.82 10.31,19.88 19.15,11.04 22.2,11.04 v23.62,12.46
AGND  (via drill 0.4 pad 0.8)
  Top 0.254: 18.75,12.65 18.89,12.51 v19.22,12.51 | 15.01,21.95 14.63,21.57 12.57,21.57 R47.1 | U5.3 15.01,21.95 | 15.01,21.95 15.01,22.68 v14.84,22.84 | 15.58,29.7 v15.58,29.89 | C21.2 30.36,18.75 v30.41,18.8 | 22.05,12.61 v21.95,12.5 | C22.2 22.78,14 C14.2 C1.2
  Top 0.4: SUPPLY7.P$2 15.48,11.34 15.65,11.17 R33.1
  Top 0.5: 15.58,29.7 14.63,28.75 R43.1
  Top 0.61: C19.2 25.35,12.96 v24.89,12.5 | v27.23,12.25 27.55,12.57 27.55,13.37 C20.2 | R36.1 25.55,34.97 27.02,33.5 v28.72,33.5 | 22.05,12.61 22.05,13.37 C14.2 | SUPPLY7.P$2 15.67,12.73 | 15.67,12.73 15.88,13.05 18.68,13.05 v19.22,12.51 | C4.2 15.55,12.55 15.67,12.73
  Route15 0.254: 27.19,12.93 27.19,12.29 v27.23,12.25 | v30.41,18.8 27.19,15.58 27.19,12.93 | 27.19,12.93 25.32,12.93 v24.89,12.5 24.25,13.14 22.59,13.14 v21.95,12.5 21.86,12.59 19.22,12.59 | 19.22,12.59 13.89,17.92 13.89,21.89 v14.84,22.84 14.84,29.16 v15.58,29.89 25.12,29.89 v28.72,33.5 | 19.22,12.59 v19.22,12.51
  Bottom 0.254: v21.95,12.5 21.95,11.32 20.95,10.33 R4.1
  pour Route15: 24.15,38.35 17.85,38.35 9.65,30.15 11.25,28.55 11.25,18.85 18.85,11.25 28.55,11.25 31.65,14.35 31.65,19.95 29.45,22.15 29.45,33.45 24.55,38.35
AREF  (via drill 0.35, 0.4 pad 0.8)
  Top 0.254: v21.31,18.58 21.45,18.45 IC2.20 21.45,16.53 21.54,16.44 22.05,15.93 C14.1 | v14.57,18.9 14.39,19.09 14.39,20.59 14.1,20.9 14.1,21.11 13.94,21.01 U5.2 | v13.65,24.05 12.34,24.05
  Top 0.4: R48.1 12.34,24.05 12.34,23.64 12.18,23.46 R46.2
  Route2 0.254: v14.57,18.9 13.65,19.82 v13.65,24.05
  Route15 0.254: v14.57,18.9 15.02,18.45 21.18,18.45 v21.31,18.58
AVCC
  Top 0.254: L1.2 17.3,16.39
  Top 0.4: IC2.18 19.85,16.45 19.35,15.95 17.15,15.95
  Top 0.61: C4.1 17,14.9 17.15,15.05 17.15,15.95 17.15,16.54 L1.2
B+
  Bottom 0.381: R11.2 24.16,32.85 23.76,33.25 D2.3
B-
  Bottom 0.381: D2.4 16.74,31.94 16.15,31.94 T5.3
B-BASE
  Bottom 0.381: R26.2 12.01,31.25 R23.1 13.29,31.25 13.55,30.99 13.95,30.99 T5.1
BTN1
  Top 0.17: IC2.32 27.07,24.45 27.6,24.99 30.75,24.99 31.07,25.31 31.07,29.32 30.04,30.35 BTN1.1
G+
  Bottom 0.381: R12.2 24.16,37.05 23.76,36.65 D2.1
G-
  Bottom 0.381: D2.6 17.35,37.35 T4.3
G-BASE
  Bottom 0.17: 12.01,36.55 12.01,36.5 | T4.1 13.44,36.4
  Bottom 0.381: 12.01,36.55 R22.1 13.29,36.55 13.44,36.4 | R25.2 11.55,36.04 12.01,36.5
GND  (via drill 0.4 pad 0.8)
  Top 0.381: v22.67,24.47 23.05,24.86 23.05,24.96 IC2.3 | v21.18,24.52 21.39,24.73 21.39,25.88 IC2.5 21.45,26.92 21.66,26.92 21.9,27.16 C18.2 | v22.27,18.78 22.25,18.77 22.25,18.34 IC2.21 | v18.04,8.79 18.55,9.3 18.55,10.06 R3.1 18.55,10.52 18.7,10.37 Q1.2 | v16.02,38.98 16.3,38.79 16.7,38.4 C2.2 16.1,37.35 16.1,36 16.16,35.95 16.4,35.95 | Q11.2 13.72,3.61 13.96,3.61 v14.18,3.38 | v6.57,22.09 6.57,22.03 6.61,21.79 U1.5 | v23.65,39.27 23.65,37.87 23.3,37.52 Q9.2 | 29.8,24.04 29.92,24.16 v30.48,24.16 | v36.38,31.19 36.45,31.12 R49.2 | SUPPLY7.P$1 13.55,12.25 12.43,13.37 v11.85,13.37 11.46,13.77 10.85,13.77 IN-.1 | IN-.1 9.49,18.01 9.49,18.95 U$1.3 | U$1.2 9.49,17.75 9.49,16.91 9.24,16.65 | IN-.1 9.24,16.65 | U$1.1 9.07,16.48 9.24,16.65 | C3.2 16.11,34.74 16.11,35.66 16.39,35.95 16.4,35.95 | 16.4,35.95 | U$3.2 16.4,35.95 | 29.8,24.04 29.53,24.31 IC3.4 | C12.2 29.8,24.04
  Route2 0.381: 22.93,24.21 22.27,23.55 v22.27,18.78 | 26.68,27.96 22.93,24.21 | 22.93,24.21 v22.67,24.47 21.23,24.47 v21.18,24.52 | 17.94,8.69 v18.04,8.79 | 18.46,7.67 17.94,8.19 17.94,8.69 | v11.85,13.37 13.26,13.37 17.94,8.69 | v16.02,38.98 23.46,39.08 v23.65,39.27 26.53,39.27 BTN2.1 | 22.76,7.06 19.07,7.06 18.46,7.67 | 18.46,7.67 v14.18,3.38 | v11.85,13.37 6.93,13.37 v6.88,13.33 | 22.76,7.06 27.14,11.45 28.97,11.45 32.33,14.81 32.33,20.24 30,22.57 30,23.69 v30.48,24.16 26.68,27.96 | BTN2.1 26.68,33.38 26.68,27.96 | 11.85,22.09 11.85,23.91 v13.27,25.32 | v11.85,13.37 11.85,22.09 | 11.85,22.09 v6.57,22.09 | 23.88,2.98 22.76,4.1 22.76,7.06 | J1.6 28.18,2.97 23.88,2.97 23.88,2.98 | 23.88,2.98 v22.89,2 | BTN2.1 31.67,36.25 36.38,31.54 v36.38,31.19
  Bottom 0.381: 16.48,10.01 17.7,8.79 v18.04,8.79 | 15.04,38.3 15.23,38.3 v16.02,38.98 | v23.65,39.27 21.3,36.92 21.3,30.54 C10.1 21.99,29.75 C6.1 | v6.88,13.33 6.87,13.33 6.59,13.05 IC1.2 4.9,13.05 C7.2 3.95,14.99 4.37,15.42 Q4.2 5.07,15.5 5.42,15.15 5.71,15.15 | v22.89,2 22.97,2.08 22.97,2.41 Q10.2 | U3.1 30.59,4.31 J1.6 | 13.7,9.9 13.9,10.09 16.1,10.09 16.19,10.01 16.48,10.01 | C9.2 13.7,9.9 | 13.7,9.9 13.84,9.9 C17.2 | C15.2 17.27,10.7 C16.2 16.48,10.01 | 11.31,13.6 11.54,13.37 v11.85,13.37 | v11.85,13.37 | C8.2 11.31,13.6 | 11.31,13.6 11.54,13.6 12.06,14.12 U2.13 | 5.71,15.15 C11.2 6.4,15.94 6.35,15.99 R16.2 R15.2 R20.2 | 5.71,15.15 | 13.18,26.52 13.18,25.41 v13.27,25.32 | 13.18,26.52 13.18,26.27 12.77,25.87 U2.21 | U2.22 13.18,26.52 | R7.2 12.91,35.2 T3.2 14.99,35.2 | R22.2 12.65,38.19 12.8,38.19 12.91,38.3 T4.2 15.04,38.3 | R23.2 12.76,32.25 12.91,32.1 T5.2 14.99,32.1 15.05,32.16 15.05,35.14 14.99,35.2 | 14.99,35.2 15.04,35.25 15.04,38.3
  Bottom 0.4: U3.1
  pour Route2 (no thermals): -1.65,41.85 41.35,41.85 41.35,1.55 37.85,-1.95 33.85,-1.95 2.75,-1.95 -1.75,2.55 -1.75,41.75
  pour Route15: -0.75,20.35 8.85,20.35 18.65,10.65 28.95,10.55 32.25,13.85 32.25,20.55 30.05,22.55 30.05,33.95 25.05,39.05 17.05,39.05 9.35,31.35 5.15,31.35 -0.75,25.45 -0.75,20.85 -1.95,22.05 -1.95,34.35 9.35,45.65 34.15,45.65 47.35,32.45 47.35,12.75 32.15,-2.45 1.45,-2.45 -0.75,-0.25
  pour Top (no thermals): -2.35,45.15 42.65,45.15 42.05,-2.55 -2.95,-2.55
  pour Bottom (no thermals): -3.15,43.15 41.45,43.15 41.45,-0.95 -3.15,-0.95
GND_OUT  (via drill 0.4 pad 0.38)
  Top 0.61: U1.1 4.05,26.05 3.85,26.25 3.65,26.25 4.25,26.85 4.25,26.95 4.75,26.45 4.75,26.25 4.65,26.15 4.25,26.15 4.85,26.75 5.05,26.75 4.35,27.45 4.35,27.65 3.05,26.35 3.05,26.25 3.65,25.65 4.65,25.65 5.35,26.35 5.35,27.15 4.35,28.15 4.35,28.35 2.95,26.95 2.85,26.95 2.75,26.85 2.75,25.15 2.85,25.25 5.05,25.25 5.75,25.95 5.75,27.55 4.35,28.95 4.25,28.95 2.25,26.95 2.25,25.05 2.55,24.75 5.35,24.75 5.75,25.15 5.75,26.05 5.95,25.85 5.95,24.35 U1.2 | U1.2 2.05,24.35 2.05,27.55 2.15,27.65 4.05,29.55 4.15,29.55 5.45,28.25 6.15,28.25 5.95,28.05 5.95,25.55 5.89,25.61 5.5,25.61 v5.55,25.65 | U1.2
  Route2 0.61: v5.55,25.65 5.55,24.95 6.15,24.35 | 6.15,24.35 6.15,28.75 5.35,29.55 4.05,29.55 3.25,28.75 3.05,28.75 2.55,28.25 2.55,24.25 2.85,24.25 | 2.85,24.25 3.35,24.75 4.65,24.85 | 4.65,24.85 5.15,24.35 6.15,24.35 | 6.15,24.35 5.85,24.05 2.55,24.05 2.55,24.15 3.05,24.15 | 3.05,24.15 4.75,24.15 | 4.75,24.15 6.05,24.15 5.65,24.55 5.25,24.55 5.45,24.75 5.45,24.85 4.85,24.85 4.85,25.45 | 4.85,25.45 4.95,25.35 5.25,25.35 | 5.25,25.35 5.85,25.35 5.85,26.05 5.75,25.95 4.75,25.95 5.45,26.65 5.85,26.65 4.65,26.65 5.25,27.25 5.95,27.25 5.25,27.95 3.45,27.95 3.45,25.65 | 3.45,25.65 3.45,25.05 3.25,24.85 3.05,24.85 3.05,25.55 | 3.05,25.55 3.05,27.95 3.35,28.25 3.85,28.75 3.85,26.05 | 3.85,26.05 3.85,24.45 | 3.85,24.45 4.05,24.25 4.05,25.75 | 4.05,25.75 4.05,28.05 4.45,28.45 4.45,24.95 | 4.45,24.95 4.45,24.35 4.75,24.05 v5.55,24.35 | v2.35,25.65 2.95,25.65 3.05,25.55 | v3.15,25.65 3.45,25.65 | v4.75,25.65 4.85,25.55 4.85,25.45 | 4.65,24.85 4.5,24.85 v4.36,24.99 4.4,24.95 4.45,24.95 | v4.75,24.35 4.75,24.15 | v3.15,24.35 3.05,24.25 | 3.05,24.25 3.05,24.15 | v5.16,24.99 5.16,25.26 5.25,25.35 | v3.95,24.35 3.85,24.45 | v3.95,25.65 4.05,25.75 | 4.05,25.75 4.05,25.85 3.85,26.05 | v3.15,24.35 2.95,24.35 2.85,24.25 | v3.15,24.35 3.05,24.25 | 3.05,24.25 3.05,24.15
  Route15 0.61: v5.55,24.35 3.25,24.45 2.65,24.55 5.65,25.85 5.65,25.15 5.25,25.15 5.55,28.05 4.65,25.15 5.05,28.15 4.05,25.15 4.55,28.25 3.35,25.05 4.05,28.45 2.65,24.85 5.75,24.85 2.25,24.35 | 2.25,24.35 U1.2 5.95,24.35 5.95,28.35 3.65,28.85 2.15,24.35 | v2.35,24.35 2.25,24.35
  Bottom 0.17: 5.05,28.75 5.05,30.42 R18.2 | R18.2
  Bottom 0.6: 5.05,28.75 4.25,27.95 4.15,28.05 2.65,28.05 | 2.65,28.05 3.55,28.95 4.95,27.55 4.95,26.45 5.05,26.35 5.05,25.75 4.55,26.25 4.55,27.05 4.75,26.85 4.85,26.85 4.45,26.45 4.45,25.75 4.15,26.05 4.15,27.55 4.35,27.35 5.25,27.35 5.35,27.25 5.35,25.45 4.05,25.45 4.15,25.55 3.95,25.75 3.95,27.85 5.45,27.85 5.65,27.65 5.65,25.05 3.55,25.05 3.55,27.85 4.05,28.35 5.55,28.35 6.05,27.85 6.05,24.75 5.85,24.55 3.15,24.55 3.05,24.65 3.05,27.85 3.85,28.65 6.05,28.65 6.35,28.35 6.35,24.25 2.65,24.25 2.65,28.05 | 2.65,28.05 3.15,28.55 3.35,28.55 3.45,28.45 J2.1
  Bottom 0.61: v3.95,25.65 3.95,25.75 | v3.15,24.35 3.05,24.25 2.65,24.25
GND_OUT_MEASURE  (via drill 0.3 pad 0.51)
  Top 0.17: 3.44,17.75 4.03,17.75 U$1.9 | U$1.7 3.44,17.75 | 3.44,17.75 3.44,16.48 U$1.8
  Top 0.5: 0.75,21.95 0.75,22.55 1.65,22.55 2.16,23.06 U1.3 2.85,22.65 | 0.75,21.95 0.75,21.42 | 0.75,21.42 0.94,21.24 | 0.94,21.24 v1.11,21.07 1.11,20.85 | 1.11,20.85 1.11,19.49 1.25,19.35 | 1.25,19.35 1.65,18.95 | 1.65,18.95 1.65,13.85 2.05,13.45 2.15,13.45 | 2.15,13.45 2.45,13.45 | 2.45,13.45 2.95,13.45 | 2.95,13.45 5.85,13.45 6.35,13.95 6.35,14.25 | 4.55,23.05 5.15,23.05 5.35,22.85 5.35,22.45 | 4.55,23.05 U1.3 2.1,22.3 | 2.1,22.3 1.85,22.05 0.85,22.05 0.75,21.95 | 6.35,14.25 6.35,14.95 | 6.35,14.95 6.35,15.75 | 6.35,15.75 6.35,16.05 | 6.35,16.05 6.35,20.45 | 6.35,20.45 6.35,20.65 5.9,21.1 | 5.9,21.1 5.35,21.65 | 5.35,21.65 5.35,21.95 | 5.35,21.95 5.35,22.25 | 5.35,22.25 5.35,22.45 | 0.75,21.42 0.98,21.65 1.65,21.65 | 1.65,21.65 3.15,21.65 | 3.15,21.65 5.35,21.65 | 2.85,22.65 U1.4 | 5.35,22.25 3.85,22.25 | 3.85,22.25 2.95,22.25 | 2.95,22.25 2.15,22.25 2.1,22.3 | 2.85,22.65 5.15,22.65 5.35,22.45 | 5.35,21.95 4.15,21.95 3.85,22.25 | 0.94,21.24 1.33,21.24 1.88,20.68 | 1.88,20.68 U$1.5 | 1.65,21.65 1.65,21.25 | 1.65,21.25 1.65,18.95 | 1.25,19.35 1.25,20.71 1.11,20.85 | 1.65,21.25 5.75,21.25 5.9,21.1 | 5.9,21.1 2.3,21.1 1.88,20.68 | 1.88,20.68 6.12,20.68 6.35,20.45 | U$1.5 2.15,20.02 2.15,19.25 | 2.15,19.25 2.15,13.45 | 2.45,13.45 2.45,18.85 | 2.45,18.85 2.45,20.11 U$1.5 | U$1.5 2.95,19.61 2.95,16.15 | 2.95,16.15 2.95,15.85 | 2.95,15.85 2.95,15.55 | 2.95,15.55 2.95,14.95 | 2.95,14.95 2.95,14.35 | 2.95,14.35 2.95,14.05 | 2.95,14.05 2.95,13.75 | 2.95,13.75 2.95,13.45 | 2.95,13.75 5.85,13.75 6.05,13.95 | 6.05,13.95 6.35,14.25 | 2.95,16.15 6.25,16.15 6.35,16.05 | 6.35,15.75 3.15,15.75 2.95,15.55 | 2.95,15.55 5.75,15.55 5.95,15.35 | 5.95,15.35 6.35,14.95 | 6.05,13.95 6.05,14.25
  Top 0.5: 6.05,14.25 6.05,14.65 | 6.05,14.65 6.05,15.25 | 6.05,15.25 5.95,15.35 | 6.05,15.25 3.25,15.25 2.95,14.95 | 2.95,14.95 5.75,14.95 6.05,14.65 | 6.05,14.65 3.25,14.65 2.95,14.35 | 2.95,14.35 5.95,14.35 6.05,14.25 | 6.05,14.25 3.15,14.25 2.95,14.05 | 2.95,15.85 3.44,16.34 3.44,16.48 | U$1.9 2.95,16.68 2.95,16.15 | 2.45,18.85 2.44,18.85 U$1.6 2.15,19.14 2.15,19.25 | 2.95,22.25 2.95,21.85 3.15,21.65 | 4.55,23.05
  Bottom 0.17: Q3.1 1.22,20.95 v1.11,21.07
  Bottom 0.4: Q3.1 2.25,21 R14.1
N$1
  Bottom 0.17: R6.1 4.25,17.21 4.37,17.09 Q4.1 5.01,16.8 5.06,16.75 R16.1
N$2
  Bottom 0.17: IC1.4 7.84,14.41 7.7,14.41 C11.1
N$3
  Top 0.17: 15.95,5.21 15.84,5.21
  Top 0.4: 15.84,5.21 Q11.3 | 15.95,5.21 R35.1 15.36,5.85 15.1,6.11 Q7.1
N$4
  Top 0.17: T2.2 20.1,6.56 20.25,6.71
  Top 0.61: Q1.3 19.66,7.51 19.66,7.35 R8.2 20.25,6.71
N$5
  Top 0.4: Q7.3 15.76,8.95 15.56,8.93 14.27,7.64 13.85,7.64 R34.2
N$6
  Bottom 0.17: Q8.1 21.1,5.21 20.74,4.85 | 20.74,4.85 R38.1 20.74,4.85 | 20.74,4.85 20.74,4.77 21.12,4.39 Q10.3
N$7
  Bottom 0.17: R2.2 22.55,6.84 22.11,7.27 21.39,7.27 21.39,7.49 20.84,8.05 Q8.3
N$8
  Top 0.17: R37.1 R39.1
N$9
  Bottom 0.17: 3.25,18.49 3.25,18.31 R6.2 | Q3.3 3.25,18.49 | R15.1 4.71,18.49 3.25,18.49
N$10
  Top 0.381: 8.4.1 R35.2 16.95,6.54 17,6.59 Q7.2
N$11
  Top 0.17: Q9.3 22.01,38.67 21.94,38.75 Q5.1 20.7,39.49 20.61,39.49 R21.1
N$12  (via drill 0.4 pad 0.8)
  Top 0.381: 4.2.1 18.75,5.56 18.18,6.13 v18.18,6.23
  Bottom 0.381: v18.18,6.23 v18.19,6.23 18.46,5.95 Q8.2 19.2,5.16 19.15,5.11 R38.2
N$13
  Top 0.17: 22,6.16 T2.1
  Top 0.61: 22,6.16 22.55,6.71 T1.2
N$14
  Top 0.17: Q2.3 9.05,26.25 8.95,25.96 9.05,25.96 10.42,24.59 R48.2 | Q2.3 8.89,26.45 | Q2.3 9.05,27.14 8.55,27.64 R44.2
  Top 0.61: U1.8 8.4,25.61 9.05,26.25
N$15
  cutout Route15: 34.85,26.55 41.35,27.75 41.35,12.75 34.85,14.15
N$16
  cutout Route2: 34.95,26.55 41.35,27.75 41.35,12.75 34.85,14.15 34.85,26.55
N$17
  Top 0.17: R10.1 21.51,9.45 21.56,9.4
  Top 0.61: T1.1 21.56,9.4
N$19  (via drill 0.3 pad 0.51, 0.4 pad 0.38)
  Top 0.17: v20.69,37.66 20.69,37.49 21.36,36.83 Q9.1 | R42.1 13.67,5.55 Q11.1
  Top 0.4: v14.67,5.45 14.52,5.6 Q11.1
  Route15 0.17: v14.67,5.45 14.45,5.45 12.28,7.62 12.28,10.52 12.35,10.65 12.85,11.15 12.85,14.35 8.15,19.05 8.15,21.75 7.05,22.85 7.05,25.45 6.58,25.92 6.58,27.18 6.85,27.45 6.85,29.25 8.05,30.45 8.95,30.45 9.15,30.65 9.85,30.65 10.45,31.25 10.45,34.55 v9.17,35.83
  Bottom 0.17: v20.69,37.66 18.34,37.66 16.28,39.72 14.95,39.72 14.36,39.12 13.1,39.12 12.65,38.67 12.01,38.67 v9.17,35.83 | Q10.1 22.97,3.76 22.4,3.76 21.74,3.11 17.01,3.11 v14.67,5.45
N$23
  Top 0.17: R37.2 19.54,35.25 19.54,35.7 19.75,35.91 Q5.3
N$26
  Top 0.254: R49.1 36.45,28.67 36.45,28.51 34.79,26.85 IC3.7
N$32
  Bottom 0.17: Q3.2 4.2,21.69 4.1,21.69 3.84,21.95 R14.2 3.25,22.41 R27.2
OUT_BASE  (via drill 0.3 pad 0.51)
  Top 0.17: U$1.4 7.38,20.21 7.26,20.34 7.26,20.74 v7.16,20.84
  Bottom 0.17: R20.1 R19.1 5.35,20.69 5.5,20.84 v7.16,20.84
PB0  (via drill 0.3 pad 0.51)
  Top 0.17: v24.65,19.09 24.65,19.17 19.54,24.29 19.07,24.29 18.76,23.97 18.76,23.52 19.24,23.05 19.24,22.46 18.83,22.05 18.48,22.05 IC2.12
  Bottom 0.17: v24.65,19.09 25.04,19.09 28.89,15.24 28.89,13 31.11,10.77 31.11,9.45 33.18,7.38 U3.2 33.55,7.49 33.55,8.36 R31.1
PB1  (via drill 0.3 pad 0.51)
  Top 0.17: 15.13,21.25 v15.12,21.23
  Top 0.305: 15.13,21.25 16.63,21.25 IC2.13
  Bottom 0.17: R25.1 10.26,33.16 10.26,30.56 12.09,28.73 13.32,28.73 13.9,28.16 13.9,25.66 15.08,24.48 15.08,23.52 15.48,23.12 15.48,21.6 v15.12,21.23
PB2  (via drill 0.3 pad 0.51)
  Top 0.17: v14.97,20.45
  Top 0.305: IC2.14 v14.97,20.45
  Bottom 0.17: v14.97,20.45 15.1,20.45 15.8,21.15 15.8,23.26 15.4,23.66 15.4,28.23 14.7,28.93 13.89,28.93 13.77,29.05 12.23,29.05 10.58,30.7 10.58,32.87 11.06,33.35 R24.1
PB3/MOSI  (via drill 0.3 pad 0.51)
  Top 0.17: v20.15,19.94 19.86,19.65 18.48,19.65 IC2.15 16.63,19.65 16.51,19.77 15.84,19.77 15.21,19.14 15.21,18.63 14.84,18.26 14.27,18.26 11.87,20.66 9.94,20.66 9.74,20.86 9.74,22.65 9.32,23.06 U1.6
  Bottom 0.17: v20.15,19.94 20.44,19.94 21.52,21.02 24.63,21.02 24.95,20.69 24.95,20.25 24.11,19.4 24.11,18.86 27.46,15.51 27.46,13 27.95,12.51 27.95,11.83 28.34,11.44 28.34,8.03 J1.4
PB4/MISO  (via drill 0.3 pad 0.51)
  Top 0.17: J1.1 28.16,8.21 30.19,8.21 v31.66,9.67 | v19.52,21.09 20.4,21.09 20.5,20.99 20.54,21.04 v20.65,21.04 20.7,20.99 20.7,19.72 19.83,18.85 IC2.16 | 11.61,26.35 12.21,26.37 12.43,26.58 16.62,26.58 v17.73,25.47
  Top 0.4: R28.1 11.61,26.35 11.45,26.19 11.29,26.19 11.15,26.05 Q2.1
  Bottom 0.17: v20.65,21.04 20.89,21.04 21.62,21.77 22.21,21.77 24.36,23.92 26.2,23.92 31.89,18.23 31.89,9.91 v31.66,9.67 | v17.73,25.47 18.35,25.47 19.85,23.97 19.85,21.46 19.52,21.13 v19.52,21.09
PB5/SCK  (via drill 0.3 pad 0.51)
  Top 0.17: IC2.17 19.05,18.15 19.18,18.28 19.72,18.28 21.19,19.75 21.19,21.81 21.06,21.95 21.03,21.95 | v20.88,21.79 21.03,21.95 | 21.03,21.95 21.03,22.02 v19.3,23.75 | J1.3 28.21,5.62 30.03,5.62 32.53,8.12 v32.53,9.69 | v25.11,1.8 24.67,1.35 15.91,1.35 15.54,1.73 14.93,1.73 13.8,2.86 13.58,2.86 12.61,3.83 12.61,3.9 12.74,3.74 12.75,3.84 R42.2
  Bottom 0.17: v32.53,9.69 32.53,18.05 26.34,24.24 24,24.24 21.84,22.09 21.18,22.09 v20.88,21.79 | J1.3 28.21,5.62 28.21,3.8 26.21,1.8 v25.11,1.8 | v19.3,23.75 18.67,24.38 16.22,24.38 15.9,24.06 15.9,23.62 16.13,23.39 16.13,20.84 15.01,19.72 13.2,19.72 12.63,19.15 7.84,19.15 6.94,20.05 R19.2
PB6
  Top 0.305: Q6.2 22.35,31.25 19.85,28.75 19.85,26.87 IC2.7
  Bottom 0.305: Q6.2 24.66,30.75 24.4,30.49 C6.2
PB7
  Top 0.305: Q6.1 19.05,30.46 19.05,27.95 IC2.8
  Bottom 0.305: Q6.1 19.84,30.65 20,30.49 C10.2
PC3  (via drill 0.3 pad 0.51)
  Top 0.17: IC2.26 25.35,19.65 25.22,19.52 25.22,18.89 24.88,18.54 23.41,18.54 v23.12,18.83 | T2.3 21.84,3.85 21.95,3.96
  Top 0.61: v21.95,4.82 21.95,3.96 | T2.3 21.84,3.85 22.24,3.45 R1.1
  Bottom 0.17: v23.12,18.83 24.39,17.56 24.39,12.9 24.25,12.77 24.25,11.2 24.66,10.8 24.66,6.84 22.99,5.18 22.31,5.18 v21.95,4.82
PD3  (via drill 0.3 pad 0.51)
  Top 0.17: v25.41,25.58 25.02,25.58 IC2.1 24.65,25.82 24.46,25.62
  Bottom 0.17: v25.41,25.58 24.67,25.58 21.51,22.41 20.73,22.41 20.34,22.02 20.34,21.49 20.11,21.26 20.11,20.9 18.46,19.26 18.46,9.26 18.68,9.05 18.68,8.51 17.39,7.23 15.6,7.23 13.83,5.45 8.45,5.45 2.61,11.3 2.61,16.2 2.15,16.66 R17.2 2.15,17.16 2.52,16.79 Q4.3
PD4-HC05_KEY  (via drill 0.3 pad 0.51)
  Top 0.17: IC2.2 23.85,25.15 23.98,25.02 26.37,25.02 27.52,26.17 29.89,26.17 v30.53,25.53
  Bottom 0.4: U2.34 31.18,25.83 30.83,25.83 v30.53,25.53
PD5-HC05_RST  (via drill 0.3 pad 0.51)
  Top 0.17: IC2.9 16.75,24.45 16.63,24.33 16.63,24.02 v16.45,23.84
  Bottom 0.17: 16.46,23.83 v16.45,23.84
  Bottom 0.305: 16.55,23.75 16.85,23.45 16.85,20.75 16.58,20.48 16.46,20.48 15.37,19.4 15.37,16.21 16.18,15.4 U2.11
  Bottom 0.4: 16.55,23.75 16.46,23.83
PD6(PWM0)  (via drill 0.3 pad 0.51)
  Top 0.17: IC2.10 17.03,23.65 16.67,23.29 16.22,23.29 15.91,23.61 15.91,24.84 v16.62,25.55
  Bottom 0.17: v16.62,25.55 16.91,25.84 16.91,28.22 15.87,29.26 14.03,29.26 13.91,29.38 12.36,29.38 10.91,30.83 10.91,32.25 R26.1
PD7  (via drill 0.3 pad 0.51)
  Top 0.17: IC2.11 18.54,22.85 v18.69,22.69
  Bottom 0.17: v18.69,22.69 18.65,22.65 18.15,22.15 18.15,19.75 16.96,18.56 16.96,18.16 16.96,13.07 16.72,12.83 15.63,12.83 15.38,13.08 15.38,15.18 14.47,16.08 7.42,16.08 7.05,15.71 7.05,14.51 6.54,14 IC1.3
R+
  Bottom 0.381: D2.2 R13.2
R-
  Bottom 0.17: D2.5 17.84,34.95
  Bottom 0.381: T3.3 17.14,34.25 17.84,34.95
R-BASE
  Bottom 0.17: 13.29,33.3 13.24,33.35
  Bottom 0.381: R7.1 R24.2 13.24,33.35 | T3.1 13.29,33.3
REF
  Top 0.17: 10.45,22.39 13.4,22.39 13.55,22.54 U5.1
  Top 0.4: R46.1 10.45,22.39 R47.2
RST  (via drill 0.3 pad 0.51)
  Top 0.17: v24.41,20.47 24.41,21.24 25.22,22.05 IC2.29 27.96,22.05 28.06,22.15 R32.1 28.65,22.36 28.5,22.51 C12.1 | v24.41,20.47
  Bottom 0.17: v24.41,20.47 23.78,19.84 23.78,18.73 25.89,16.62 25.89,12.87 25.53,12.51 25.53,5.76 J1.5
RX(UC)  (via drill 0.3 pad 0.51)
  Top 0.17: IC2.30 25.11,22.85 v25.02,22.76
  Bottom 0.305: v25.02,22.76 31.18,16.61 U2.1
SCL
  Top 0.17: IC3.6 32.84,25.58 32.39,25.13 32.39,23.63 32.03,23.27 30.09,21.34 27.15,21.34 27.07,21.25 IC2.28
  Top 0.2: R50.1 31.85,23.1 32.03,23.27
SDA
  Top 0.17: IC3.5 33.01,24.31 32.84,24.14 32.84,22.03 31.36,22.04 30.32,21.02 27.63,21.02 27.07,20.45 IC2.27
  Top 0.254: R51.1 31.85,18.95 32.85,19.95 32.85,22.03 32.84,22.03
TX(UC)  (via drill 0.3 pad 0.51)
  Top 0.17: IC2.31 24.86,23.65 v24.59,23.38
  Bottom 0.305: U2.2 29.68,16.64 24.28,22.03 24.28,23.07 v24.59,23.38
VCC  (via drill 0.4, 0.4 pad 0.8)
  Top 0.381: 24.31,4.4 23.66,5.06 23.66,9.12 24.27,9.73 24.32,9.73 24.95,10.35 24.95,10.65 | v24.72,4.4 24.31,4.4 | 24.31,4.4 24.05,4.14 R1.2 | 24.95,10.65 24.38,11.22 22.76,11.22 22.29,10.75 R5.2 | U3.3 33.91,10.72 25.02,10.72 24.95,10.65 | v32.55,28.4 32.79,28.16 32.79,28.12 IC3.8
  Top 0.406: R51.2 33.65,19.95 | 33.65,19.95 v33.85,19.75 33.65,19.95 | R50.2 33.65,19.95
  Top 0.61: v8.55,11.13 7.3,12.33 4.23,12.35 3V3.1
  Route15 0.381: v24.72,4.4 24.72,2.77 23.2,1.25 22.59,1.25 22.34,1.5 19.45,1.5 12.84,2.82 10.85,4.8 8.98,4.8 6.85,6.93 6.85,9.24 8.55,10.95 v8.55,11.13 | v32.55,28.4 33.46,27.49 33.55,27.35 33.85,27.05 v33.85,19.75 33.85,13.05 35.46,11.44 U3.3
  Bottom 0.381: v8.55,11.13 7.92,11.13 7.57,11.48 7.57,11.6 7.31,11.86 7.31,12.1 IC1.5 8.39,12.1 | U3.3 35.02,9.17 34.24,9.95 R31.2 | C17.1 15.49,11.8
  Bottom 0.61: 8.39,12.1 9.19,12.1 9.36,11.94 9.36,11.7 C8.1 11.56,11.7 11.66,11.8 C9.1 C17.1 14.85,12.79 14.68,12.97 U2.12 | C15.1 C16.1 15.69,12 15.49,11.8
VDD  (via drill 0.4 pad 0.8)
  Top 0.381: 21.27,23.61 21.04,23.61 20.44,24.21 20.44,24.83 20.65,25.04 IC2.6 20.65,27.11 20.6,27.16 C18.1 | IC2.4 22.25,25.11 21.93,24.78 21.93,24.2 21.33,23.61 21.27,23.61 | 21.27,23.61 v21.27,23.57 | L1.1 16.11,17.3 v16.11,19.13 | v16.11,19.13 | 25.03,28.96 21.61,28.96 C18.1 | v30.22,28.96 27.25,28.96 25.03,28.96 | 25.03,28.96 25.03,28.97 | C18.1 20.6,27.96 20.56,28 | R32.2 30.15,22.15 30.29,22.29 30.29,22.44 v30.75,22.89 | R28.2 11.56,27.35 11.51,27.4 Q2.2 10.36,27.4 10.23,27.27 v10.05,27.27 | U$3.5 15.54,35.3 15.29,35.04 15,35.04 C3.1 15,32.86 15,32.45 15,31.5 14.21,30.71 9.11,30.71 8.15,29.75 7.85,29.75 7.57,29.47 v7.57,28.81
  Top 0.4: 15,32.45 17.75,32.45 18.65,33.35 24.85,33.35 27.15,31.05 27.25,30.85 27.25,28.96
  Route2 0.381: v16.11,19.13 20.09,23.11 20.09,23.57 v21.27,23.57 | v0.81,18.45 1.3,18.45 3.45,20.65 3.55,20.75 5.25,20.75 5.82,21.32 5.82,22.98 10.05,27.21 v10.05,27.27 8.51,28.82 v7.57,28.81 | v30.22,28.96 31.23,27.95 31.23,23.37 v30.75,22.89 32.86,20.78 32.86,12.73 J1.2
  Bottom 0.381: v0.81,18.45 1.01,18.25 1.46,18.25 2,18.25 R17.1
WTR-IN
  Top 0.17: PAD2.1 17.15,9.49 17.15,8.77 17.77,8.15 18.47,8.15 18.79,8.47 20.5,8.47 20.51,8.45 R10.2 | 21.15,8.09 21.25,7.99
  Top 0.61: R8.1 21.25,7.99 | R10.2 21.15,8.09
WTR_MEASURE_ON
  Top 0.17: 20,10.31 19.99,10.31
  Top 0.61: R5.1 R3.2 19.99,10.31 | Q1.1 20,10.31
WTR_MEASURE_PULLUP  (via drill 0.3 pad 0.51)
  Top 0.17: v6.63,9.94 6.63,7.3 11.4,2.53 13.67,2.53 14.85,1.36 15.23,1.36 15.56,1.03 25.11,1.03 25.65,1.57 25.65,6.76 24.75,7.66 T1.3
  Bottom 0.17: v6.63,9.94 6.55,10.02 R9.1

### Text on the board
tPlace: Rev. 5.8
tNames: B- | DiveTeam